# EasyEDA Pro project LCR表.eprj, board 电池内阻仪
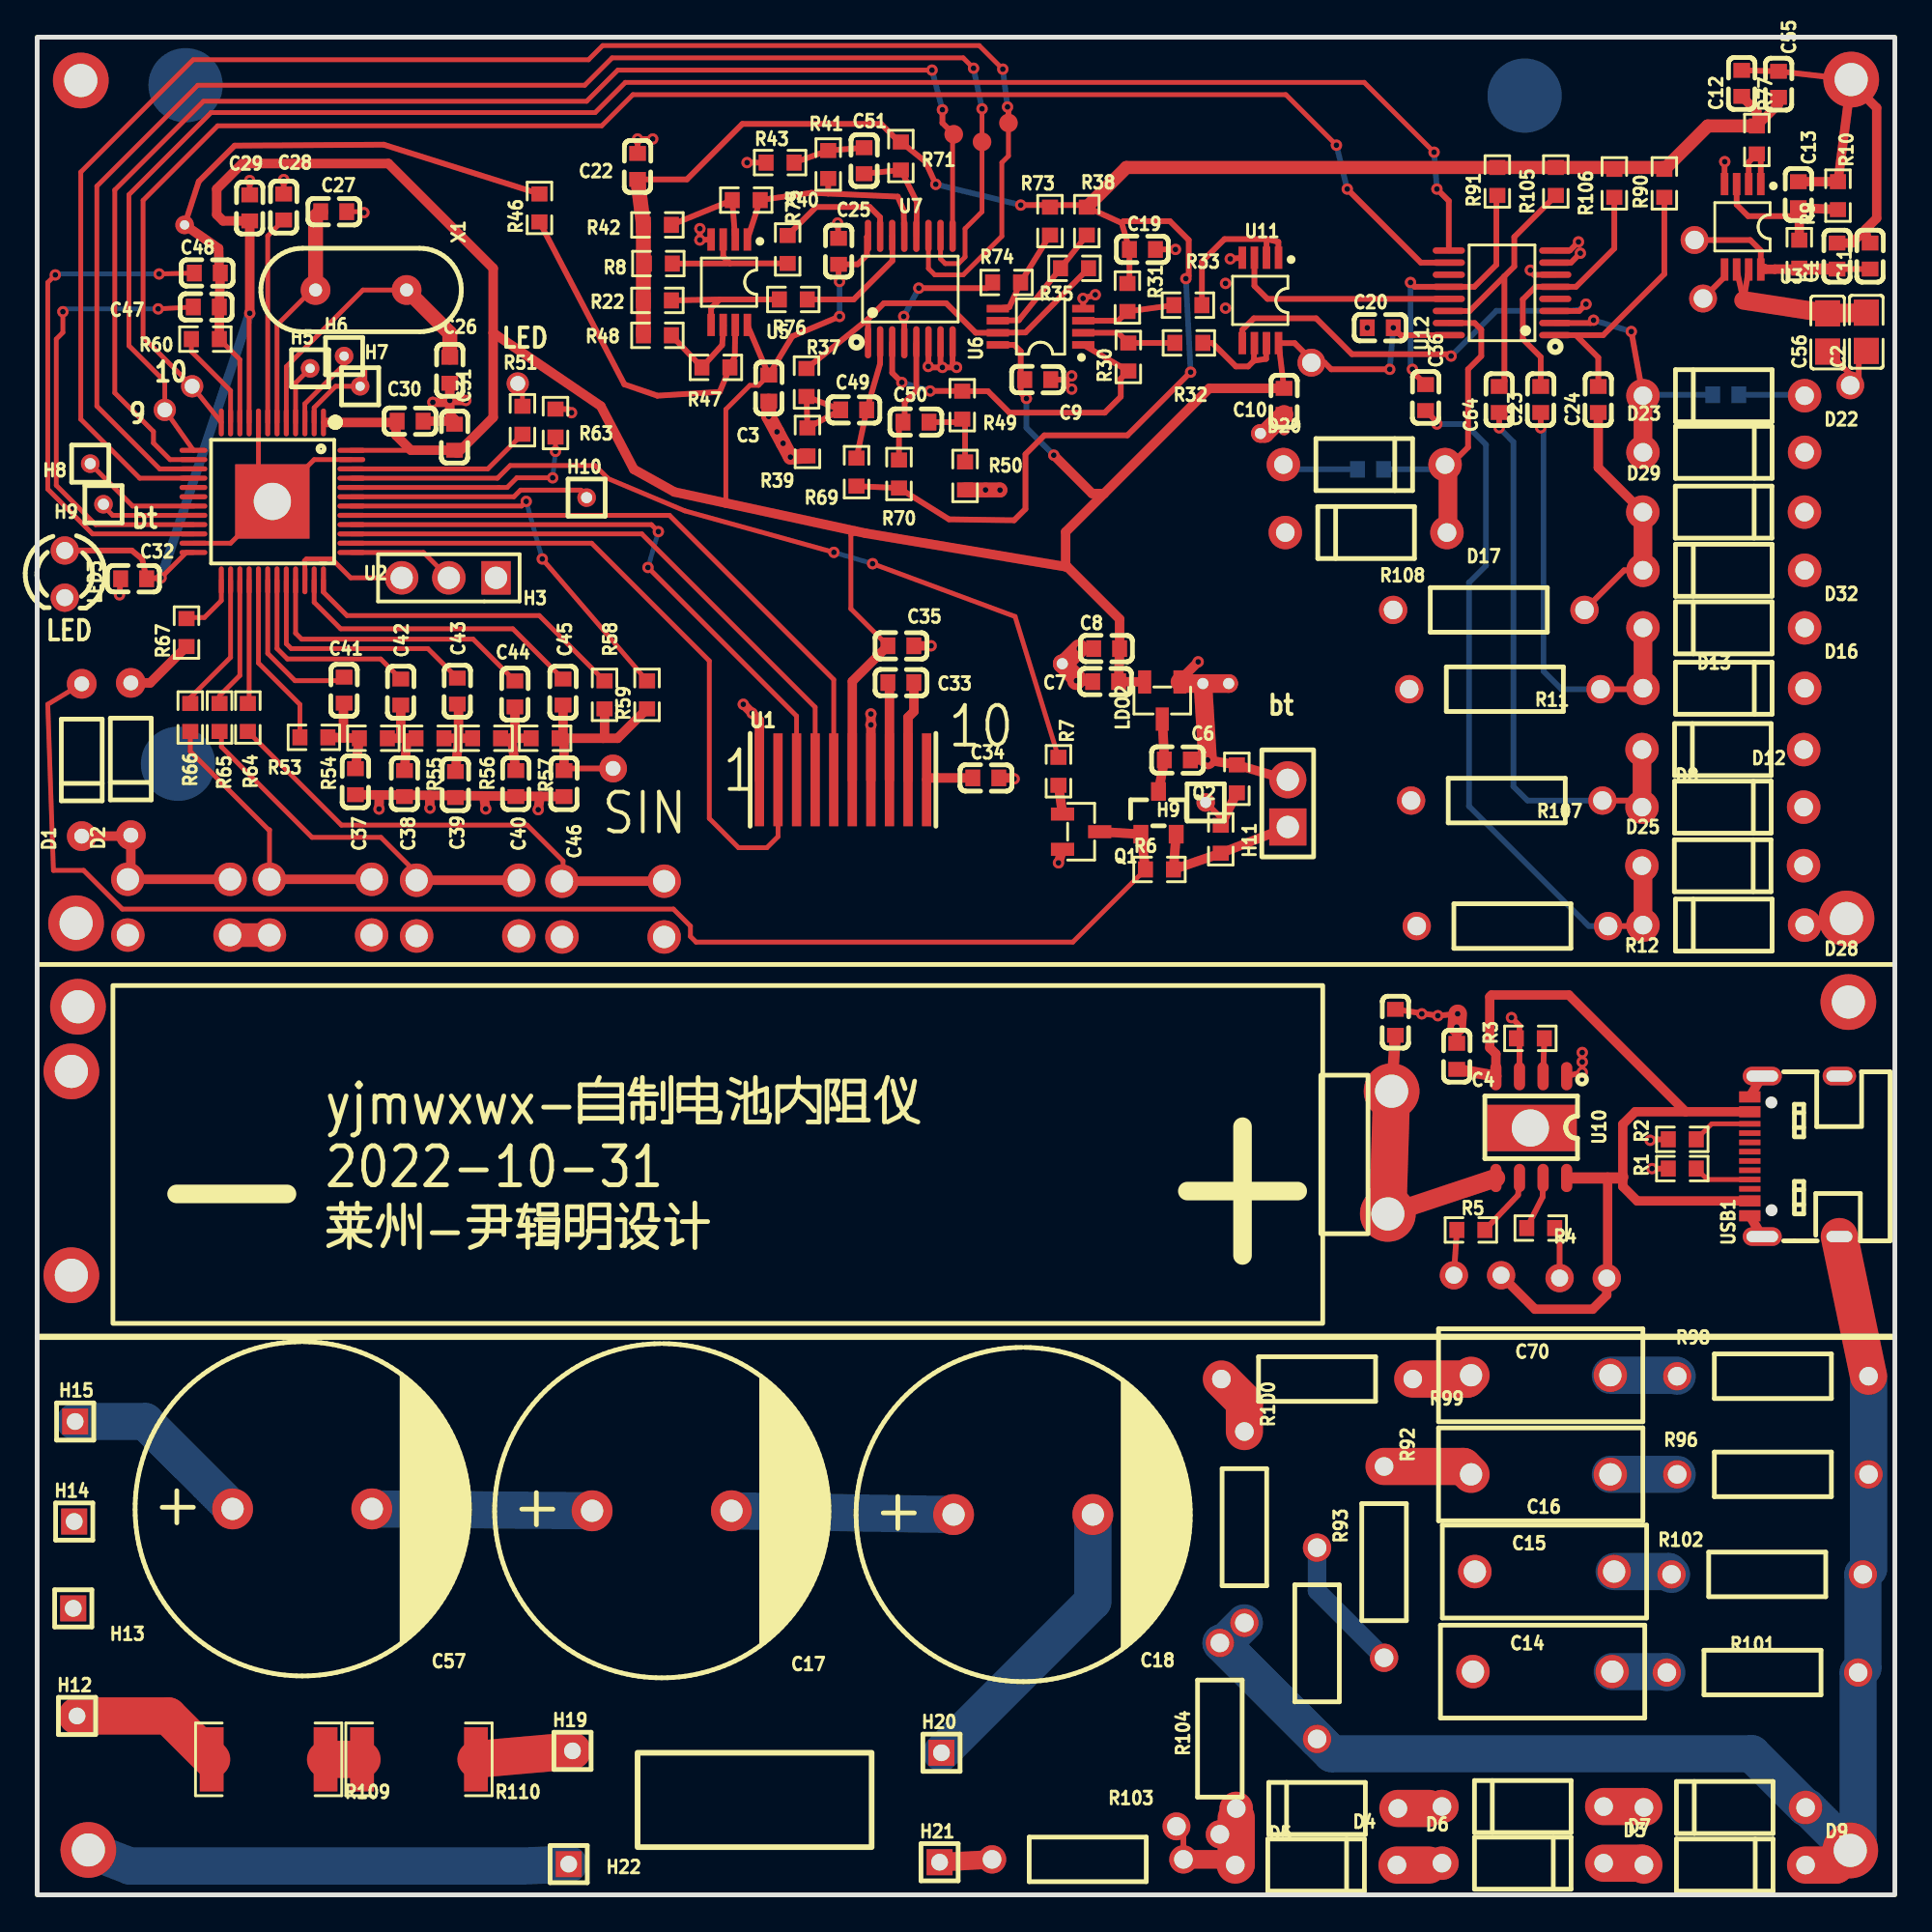
[diagram p1: board, top side]
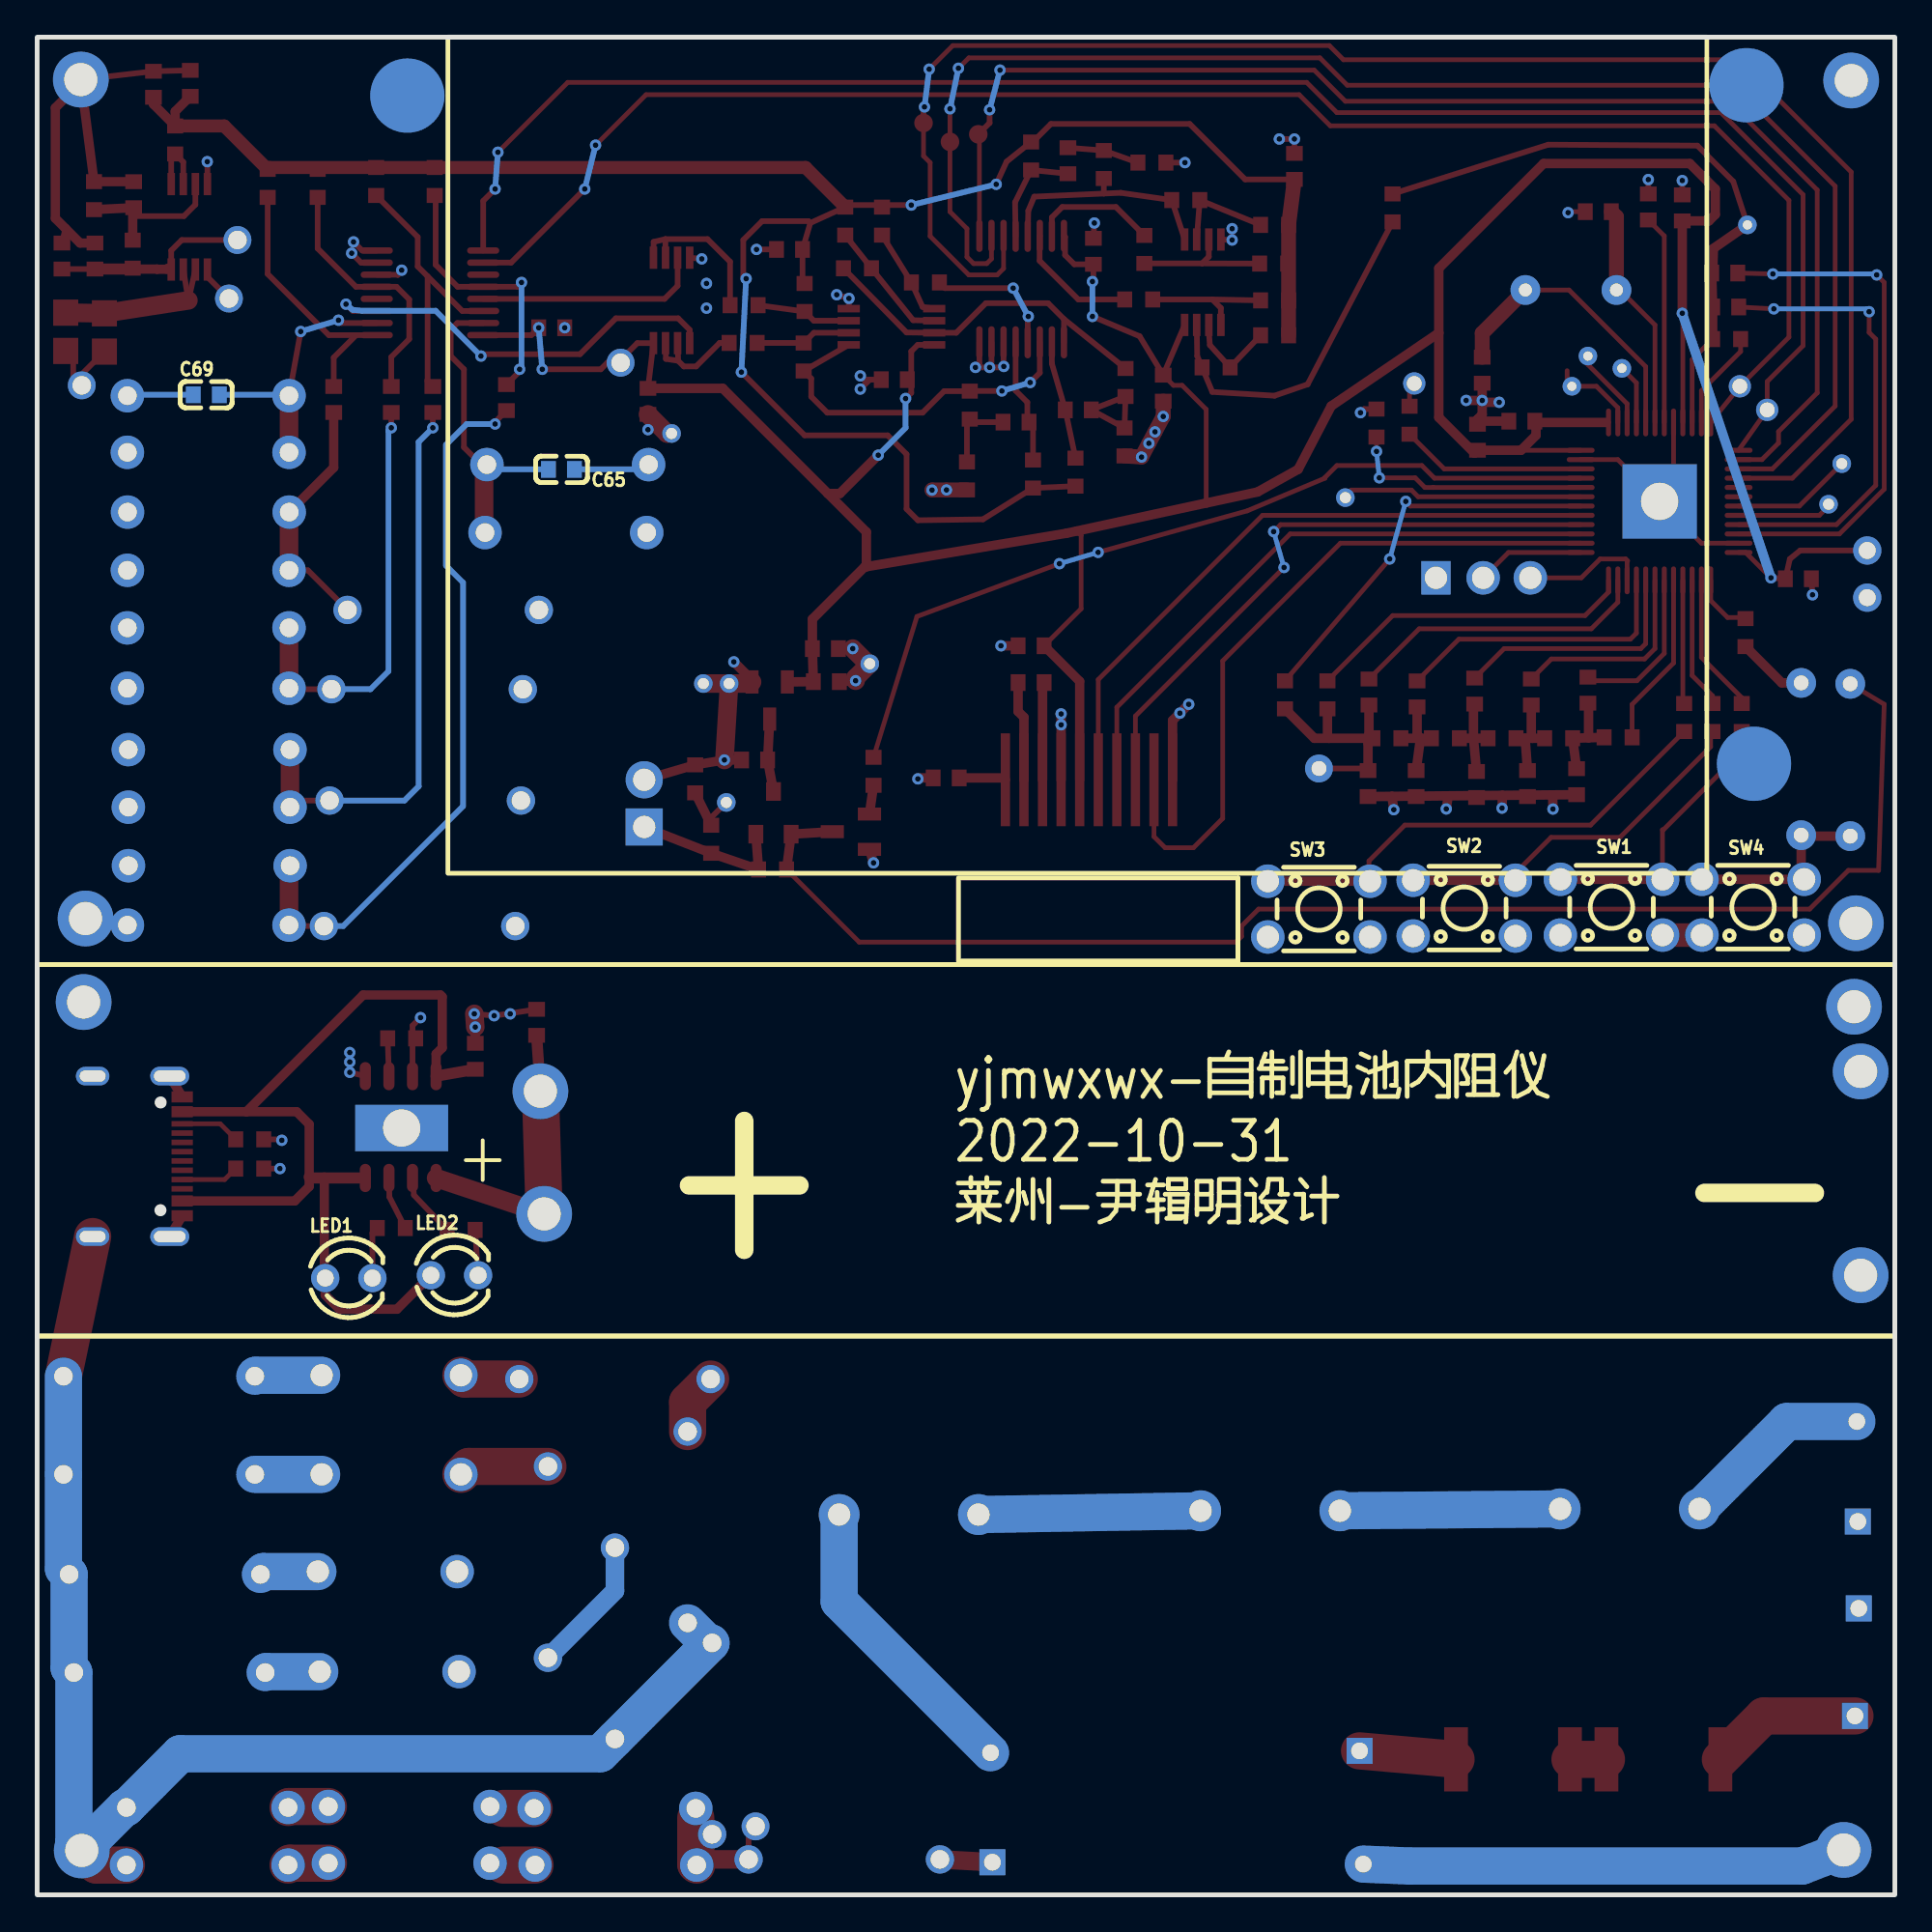
[diagram p2: board, bottom side, seen from below]

Outline 100 x 100 mm; copper layers: Top Layer, Bottom Layer. Coordinates in mm from the lower left corner of the outline.
Outline path: rectangle 0,100 100,0
Stack: Top Layer 0.035mm / Dielectric1 1.51mm FR4 er 4.5 / Bottom Layer 0.035mm

## Design rules (mm)
spacing safeClearance (default): track to track 0.152, other pairs 0.152 to 0.3
track width trackWidth (default): min 0.127, default 0.254, max 2.54
differential pair differentialPair (default): width min 0.127, default 0.254, max 2.54; gap min 0.152, default 0.152
via viaSize (default): diameter min 0.5, default 0.61, max 10; hole min 0.3, default 0.305, max 6
net GND uses copperRegion1

## Placement (name value [footprint] x y rotation side)
C1  100nF  [C0603]  96.89 88.22 90 top
C2  150nF  [C0805]  98.46 84.14 90 top
C3  150nF  [C0603]  39.38 81.11 270 top
C4  10uF  [C0603]  76.42 45.14 270 top
C5  10uF  [C0603]  73.11 46.97 270 top
C6  10uF  [C0603]  61.38 61.09 180 top
C7  100nF  [C0603]  57.52 65.31 0 top
C8  10uF  [C0603]  57.57 67.08 0 top
C9  100nF  [C0603]  53.86 81.56 0 top
C10  100nF  [C0603]  67.12 80.39 270 top
C11  100nF  [C0603]  98.67 88.22 90 top
C12  150nF  [C0603]  91.76 97.51 90 top
C13  100nF  [C0603]  94.81 91.52 270 top
C14  470uF  [CAP-TH_L11.0-W5.0-P7.50-D1.2]  81.04 12.02 0 top
C15  100nF  [CAP-TH_L11.0-W5.0-P7.50-D1.2]  81.14 17.4 0 top
C16  100nF  [CAP-TH_L11.0-W5.0-P7.50-D1.2]  80.94 22.63 0 top
C17  10uF  [CAP-TH_BD18.0-P7.50-D1.2-FD]  33.62 20.67 0 top
C18  100nF  [CAP-TH_BD18.0-P7.50-D1.2-FD]  53.08 20.47 0 top
C19  470uF  [C0603]  59.5 88.57 0 top
C20  100nF  [C0603]  72.3 84.36 0 top
C22  470uF  [C0603]  32.32 93.04 90 top
C23  470uF  [C0603]  80.94 80.5 90 top
C24  470uF  [C0603]  84.04 80.5 90 top
C25  100nF  [C0603]  43.14 88.47 270 top
C26  22pF  [C0603]  22.21 82.07 90 top
C27  22pF  [C0603]  15.96 90.61 180 top
C28  100nF  [C0603]  13.27 90.86 90 top
C29  10uF  [C0603]  11.44 90.81 90 top
C30  100nF  [C0603]  20.08 79.33 0 top
C31  100nF  [C0603]  22.47 78.46 270 top
C32  100nF  [C0603]  5.19 70.84 0 top
C33  100nF  [C0603]  46.5 65.26 180 top
C34  100nF  [C0603]  51.07 60.12 180 top
C35  100nF  [C0603]  46.5 67.24 180 top
C36  10uF  [C0603]  74.74 80.6 270 top
C37  100pF  [C0603]  17.13 59.92 90 top
C38  100pF  [C0603]  19.77 59.82 90 top
C39  100pF  [C0603]  22.52 59.77 90 top
C40  100pF  [C0603]  25.77 59.82 90 top
C41  10nF  [C0603]  16.52 64.85 90 top
C42  1nF  [C0603]  19.57 64.75 90 top
C43  40nF  [C0603]  22.62 64.8 90 top
C44  200nF  [C0603]  25.72 64.65 90 top
C45  100nF  [C0603]  28.31 64.75 90 top
C46  100pF  [C0603]  28.36 59.82 90 top
C47  100nF  [C0603]  9.11 85.47 0 top
C48  100nF  [C0603]  9.16 87.3 0 top
C49  10uF  [C0603]  43.96 79.94 180 top
C50  10uf  [C0603]  47.31 79.28 0 top
C51  470uF  [C0603]  44.51 93.35 270 top
C55  150nF  [C0603]  93.74 97.46 270 top
C56  10uF  [C0805]  96.38 84.1 90 top
C57  150uF  [CAP-TH_BD18.0-P7.50-D1.2-FD]  14.27 20.78 0 top
C64  10uF  [C0603]  78.7 80.5 90 top
C65  100nF  [C0603]  71.78 76.74 0 bottom
C69  100nF  [C0603]  90.89 80.75 180 bottom
C70  10nF  [CAP-TH_L11.0-W5.0-P7.50-D1.2]  80.94 27.97 0 top
D1  1N4148  [DO-35_BD2.0-L4.2-P8.20-D0.5-RD]  2.4 61.09 90 top
D2  1N4148  [DO-35_BD2.0-L4.2-P8.20-D0.5-RD]  5.04 61.14 90 top
D3  1N4148  [DO-41_BD2.4-L4.7-P8.70-D0.9-FD]  79.97 4.75 180 top
D4  1N4148  [DO-41_BD2.4-L4.7-P8.70-D0.9-FD]  68.9 4.65 180 top
D5  1N4148  [DO-41_BD2.4-L4.7-P8.70-D0.9-FD]  68.85 1.6 0 top
D6  1N4148  [DO-41_BD2.4-L4.7-P8.70-D0.9-FD]  79.97 1.71 0 top
D7  FR107  [DO-41_BD2.4-L4.7-P8.70-D0.9-FD]  90.84 1.6 0 top
D8  FR107  [DO-41_BD2.4-L4.7-P8.70-D0.9-FD]  90.74 58.55 0 top
D9  FR107  [DO-41_BD2.4-L4.7-P8.70-D0.9-FD]  90.84 4.7 180 top
D12  FR107  [DO-41_BD2.4-L4.7-P8.70-D0.9-FD]  90.74 61.65 180 top
D13  FR107  [DO-41_BD2.4-L4.7-P8.70-D0.9-FD]  90.79 64.95 0 top
D16  FR107  [DO-41_BD2.4-L4.7-P8.70-D0.9-FD]  90.79 68.2 180 top
D17  FR107  [DO-41_BD2.4-L4.7-P8.70-D0.9-FD]  71.54 73.33 180 top
D20  FR107  [DO-41_BD2.4-L4.7-P8.70-D0.9-FD]  71.44 76.99 0 top
D22  FR107  [DO-41_BD2.4-L4.7-P8.70-D0.9-FD]  90.79 80.7 180 top
D23  FR107  [DO-41_BD2.4-L4.7-P8.70-D0.9-FD]  90.79 77.65 0 top
D25  FR107  [DO-41_BD2.4-L4.7-P8.70-D0.9-FD]  90.73 55.4 0 top
D28  FR107  [DO-41_BD2.4-L4.7-P8.70-D0.9-FD]  90.79 52.2 180 top
D29  FR107  [DO-41_BD2.4-L4.7-P8.70-D0.9-FD]  90.78 74.43 0 top
D32  FR107  [DO-41_BD2.4-L4.7-P8.70-D0.9-FD]  90.79 71.3 180 top
H3  2.54-1*3P针  [HDR-TH_3P-P2.54-V-M-1]  22.16 70.89 180 top
H5  -  [HDR-TH_1P-V-M_XKB_X4611WV-01I-C28D40#2]  14.69 82.17 0 top
H6  -  [HDR-TH_1P-V-M_XKB_X4611WV-01I-C28D40#2]  16.52 82.83 0 top
H7  -  [HDR-TH_1P-V-M_XKB_X4611WV-01I-C28D40#2]  17.39 81.21 0 top
H8  -  [HDR-TH_1P-V-M_XKB_X4611WV-01I-C28D40]  2.86 77.04 0 top
H9  -  [HDR-TH_1P-V-M_XKB_X4611WV-01I-C28D40]  3.57 74.86 0 top
H9#2  -  [HDR-TH_1P-V-M_XKB_X4611WV-01I-C28D40]  62.9 58.8 0 top
H10  -  [HDR-TH_1P-V-M_XKB_X4611WV-01I-C28D40]  29.58 75.21 0 top
H11  18650电池  [HDR-TH_2P-P2.54-V-F]  67.32 58.75 90 top
H12  -  [HDR-TH_1P-V-M_XKB_X4611WV-01I-C28D40#3]  2.15 9.63 0 top
H13  -  [HDR-TH_1P-V-M_XKB_X4611WV-01I-C28D40#3]  1.94 15.42 0 top
H14  -  [HDR-TH_1P-V-M_XKB_X4611WV-01I-C28D40#3]  1.99 20.09 0 top
H15  -  [HDR-TH_1P-V-M_XKB_X4611WV-01I-C28D40#3]  2.05 25.48 180 top
H19  -  [HDR-TH_1P-V-M_XKB_X4611WV-01I-C28D40#3]  28.82 7.75 0 top
H20  -  [HDR-TH_1P-V-M_XKB_X4611WV-01I-C28D40#3]  48.68 7.65 0 top
H21  -  [HDR-TH_1P-V-M_XKB_X4611WV-01I-C28D40#3]  48.58 1.76 0 top
H22  -  [HDR-TH_1P-V-M_XKB_X4611WV-01I-C28D40#3]  28.61 1.65 0 top
LDO2  SC662K-3.3V  [SOT-23-3_L2.9-W1.3-P1.90-LS2.4-BR]  60.57 64.29 90 top
LED1  -  [LED-TH_BD3.0-P2.54-FD]  83.22 33.2 180 bottom
LED2  -  [LED-TH_BD3.0-P2.54-FD]  77.53 33.35 180 bottom
LED3  -  [LED-TH_BD3.0-P2.54-FD]  1.49 71.1 270 top
NOREF  -  [Pad_e209]  2.1 52.3 0 top
NOREF#2  -  [Pad_e2749]  8.34 81.21 0 top
NOREF#3  -  [Pad_e199]  97.5 48.06 0 top
NOREF#4  -  [Pad_e1343]  50.86 94.36 0 top
NOREF#5  -  [Pad_e114]  62.75 65.2 0 top
NOREF#6  -  [Pad_e1332]  52.29 95.38 0 top
NOREF#7  -  [Pad_e4477]  65.85 78.67 0 top
NOREF#8  -  [Pad_e156]  1.84 33.35 0 top
NOREF#9  -  [Pad_e1208]  89.22 89.08 0 top
NOREF#10  -  [Pad_e1199]  12.66 75.01 0 top
NOREF#11  -  [Pad_e205]  97.65 97.72 0 top
NOREF#12  -  [Pad_e1781]  97.6 81.26 0 top
NOREF#13  -  [Pad_e475]  80.07 96.85 0 top
NOREF#14  -  [Pad_e201]  97.6 2.39 0 top
NOREF#15  -  [Pad_e2863]  25.87 81.36 0 top
NOREF#16  -  [Pad_e1340]  49.34 94.77 0 top
NOREF#17  -  [Pad_e111]  55.18 66.27 0 top
NOREF#18  -  [Pad_e159]  72.71 36.66 0 top
NOREF#19  -  [Pad_e155]  1.84 44.33 0 top
NOREF#20  -  [Pad_e478]  7.99 97.41 0 top
NOREF#21  -  [Pad_e207]  2.35 97.67 0 top
NOREF#22  -  [Pad_e157]  72.91 43.26 0 top
NOREF#23  -  [Pad_e191]  2.2 47.81 0 top
NOREF#24  -  [Pad_e1224]  68.59 82.48 0 top
NOREF#25  -  [Pad_e117]  64.14 65.2 0 top
NOREF#26  -  [Pad_e1195]  89.68 85.93 0 top
NOREF#27  -  [Pad_e213]  2.76 2.42 0 top
NOREF#28  -  [Pad_e2748]  6.87 79.94 0 top
NOREF#29  -  [Pad_e211]  97.4 52.56 0 top
NOREF#30  -  [Pad_e3196]  31 60.63 0 top
NOREF#31  -  [Pad_e3514]  7.94 89.89 0 top
NOREF#32  -  [Pad_e1775]  80.38 41.28 90 top
NOREF#33  -  [Pad_e1779]  61.33 3.69 0 top
NOREF#34  -  [Pad_e479]  7.58 60.89 0 top
Q1  AO3400A  [SOT-23-3_L2.9-W1.3-P1.90-LS2.4-BR]  56.2 57.23 180 top
Q2  AO3401A  [SOT-23_L2.9-W1.3-P1.90-LS2.4-BR]  60.36 58.25 270 top
R1  10K  [R0603]  88.56 39.09 180 top
R2  10K  [R0603]  88.56 40.67 0 top
R3  1.3K  [R0603]  80.38 46.1 0 top
R4  1K  [R0603]  80.94 35.89 0 top
R5  1K  [R0603]  77.18 35.79 180 top
R6  10K  [R0603]  60.41 55.2 0 top
R7  10K  [R0603]  54.98 60.48 270 top
R8  1Ω  [R0603]  33.44 87.81 180 top
R9  1Ω  [R0603]  94.86 88.32 270 top
R10  10  [R0603]  96.94 91.47 270 top
R11  10K  [RES-TH_BD2.4-L6.3-P10.30-D0.6]  79.01 64.9 180 top
R12  10K  [RES-TH_BD2.4-L6.3-P10.30-D0.6]  79.41 52.15 180 top
R22  100  [R0603]  33.39 85.83 180 top
R30  10K  [R0603]  58.74 82.78 90 top
R31  1K  [R0603]  58.69 85.99 270 top
R32  1K  [R0603]  62 83.54 180 top
R33  1K  [R0603]  61.95 85.57 180 top
R35  6K  [R0603]  55.84 87.56 0 top
R37  900  [R0603]  41.41 81.41 90 top
R38  1K  [R0603]  56.5 90.1 270 top
R39  100  [R0603]  41.47 78.21 90 top
R40  10K  [R0603]  38.17 91.23 0 top
R41  1K  [R0603]  42.58 93.14 270 top
R42  1K  [R0603]  33.39 89.89 0 top
R43  500  [R0603]  39.99 93.25 0 top
R46  100  [R0603]  27.04 90.81 90 top
R47  10K  [R0603]  36.54 82.22 0 top
R48  3.33K  [R0603]  33.39 83.95 0 top
R49  500  [R0603]  49.8 80.19 90 top
R50  100  [R0603]  49.95 76.38 270 top
R51  1K  [R0603]  26.12 79.38 270 top
R53  1K  [R0603]  14.9 62.31 0 top
R54  1K  [R0603]  18.1 62.26 0 top
R55  1K  [R0603]  21.15 62.26 0 top
R56  1K  [R0603]  24.19 62.26 0 top
R57  1K  [R0603]  27.34 62.26 0 top
R58  10K  [R0603]  30.54 64.6 90 top
R59  10K  [R0603]  32.83 64.6 90 top
R60  10K  [R0603]  9.06 83.75 180 top
R61  10K  [R0603]  63.72 56.82 90 top
R62  10K  [R0603]  64.58 60.07 90 top
R63  10K  [R0603]  27.9 79.23 270 top
R64  10K  [R0603]  11.34 63.38 90 top
R65  10K  [R0603]  9.82 63.38 90 top
R66  10K  [R0603]  8.24 63.38 90 top
R67  10K  [R0603]  8.04 67.95 90 top
R69  100K  [R0603]  44.11 76.58 90 top
R70  100K  [R0603]  46.39 76.48 90 top
R71  1Ω  [R0603]  46.5 93.6 90 top
R73  6K  [R0603]  54.52 90.1 90 top
R74  1K  [R0603]  52.18 86.8 0 top
R75  100K  [R0603]  40.4 88.57 270 top
R76  100K  [R0603]  40.7 85.88 180 top
R77  100K  [R0603]  92.57 94.47 270 top
R90  10K  [R0603]  87.59 92.13 90 top
R91  10K  [R0603]  78.6 92.23 90 top
R92  10kΩ  [RES-TH_BD2.4-L6.3-P10.30-D0.6]  72.5 17.91 270 top
R93  10kΩ  [RES-TH_BD2.4-L6.3-P10.30-D0.6]  68.9 13.54 270 top
R96  100  [RES-TH_BD2.4-L6.3-P10.30-D0.6]  93.43 22.63 0 top
R98  10kΩ  [RES-TH_BD2.4-L6.3-P10.30-D0.6]  93.43 27.92 0 top
R99  10kΩ  [RES-TH_BD2.4-L6.3-P10.30-D0.6]  68.9 27.77 180 top
R100  10kΩ  [RES-TH_BD2.4-L6.3-P10.30-D0.6]  64.99 19.79 270 top
R101  10kΩ  [RES-TH_BD2.4-L6.3-P10.30-D0.6]  92.88 11.97 0 top
R102  10kΩ  [RES-TH_BD2.4-L6.3-P10.30-D0.6]  93.13 17.25 0 top
R103  100  [RES-TH_BD2.4-L6.3-P10.30-D0.6]  56.55 1.91 0 top
R104  1kΩ  [RES-TH_BD2.4-L6.3-P10.30-D0.6]  63.66 8.41 270 top
R105  10K  [R0603]  81.75 92.23 90 top
R106  10K  [R0603]  84.9 92.13 90 top
R107  1kΩ  [RES-TH_BD2.4-L6.3-P10.30-D0.6]  79.11 58.91 180 top
R108  1kΩ  [RES-TH_BD2.4-L6.3-P10.30-D0.6]  78.14 69.17 0 top
R109  0.5Ω  [R2512]  12.46 7.29 180 top
R110  0.5Ω  [R2512]  20.55 7.29 180 top
SW1  TC-1109-C-B  [KEY-TH_4P-L4.5-W4.5-P3.00-LS5.8]  15.25 53.17 180 bottom
SW2  TC-1109-C-B  [KEY-TH_4P-L4.5-W4.5-P3.00-LS5.8]  23.18 53.11 180 bottom
SW3  TC-1109-C-B  [KEY-TH_4P-L4.5-W4.5-P3.00-LS5.8]  31 53.06 180 bottom
SW4  TC-1109-C-B  [KEY-TH_4P-L4.5-W4.5-P3.00-LS5.8]  7.63 53.17 180 bottom
U1  -  [FPC10]  42.38 60.02 0 top
U2  N32G430C8L7  [LQFP-48_L7.0-W7.0-P0.50-LS9.0-BL]  12.66 75.01 180 top
U3  COS722MR  [MSOP-8_L3.0-W3.0-P0.65-LS4.9-BL-1]  91.81 89.79 180 top
U5  COS722MR  [MSOP-8_L3.0-W3.0-P0.65-LS4.9-BL-1]  37.25 86.81 180 top
U6  COS722MR  [MSOP-8_L3.0-W3.0-P0.65-LS4.9-BL-1]  54.01 84.41 90 top
U7  COS722MR  [TSSOP-16_L5.0-W4.4-P0.65-LS6.4-BL]  47 86.44 0 top
U10  WSP4056  [SOP-8_L5.1-W3.9-P1.27-LS6.0-BL]  80.43 41.33 180 top
U11  COS722MR  [MSOP-8_L3.0-W3.0-P0.65-LS4.9-BL-1]  65.85 85.83 180 top
U12  -  [TSSOP-16_L5.0-W4.4-P0.65-LS6.4-BL]  78.85 86.24 90 top
USB1  TYPEC-304-ACP16  [USB-C-SMD_TYPE-C-16P-1]  94.6 39.75 90 top
X1  8MHz  [OSC-TH_L10.0-W4.5-P5.00]  17.44 86.39 270 top

## Footprints (pads in the part's own frame, mm; a bottom-side part is the same pattern mirrored in y, then rotated)
C0603
  rect 0.8x0.9 smd: 1(-0.7,0) 2(0.7,0)
C0805
  rect 1.41x1.35 smd: 1(-1.03,0) 2(1.03,0)
CAP-TH_BD18.0-P7.50-D1.2-FD
  round 2.2 hole 1.199: 1(-3.749,0) 2(3.749,0)
CAP-TH_L11.0-W5.0-P7.50-D1.2
  round 1.801 hole 1.199: 1(-3.749,0) 2(3.749,0)
DO-35_BD2.0-L4.2-P8.20-D0.5-RD
  round 1.6 hole 0.8: 1(-4.099,0) 2(4.099,0)
DO-41_BD2.4-L4.7-P8.70-D0.9-FD
  round 1.801 hole 1.001: 1(-4.351,0) 2(4.351,0)
FPC10
  rect 0.5x5 smd: 1(-3.5,0) 2(-2.5,0) 3(-1.5,0) 4(-0.5,0) 5(0.5,0) 6(1.5,0) 7(2.5,0) 8(3.5,0) 9(4.5,0) 10(5.5,0)
HDR-TH_1P-V-M_XKB_X4611WV-01I-C28D40
  round 1 hole 0.6: 1(0,0)
HDR-TH_1P-V-M_XKB_X4611WV-01I-C28D40#2
  round 1 hole 0.5: 1(0,0)
HDR-TH_1P-V-M_XKB_X4611WV-01I-C28D40#3
  rect 1.399x1.399 hole 0.899: 1(0,0)
HDR-TH_2P-P2.54-V-F
  rect 1.999x1.999 hole 1.199: 1(-1.27,0)
  round 1.999 hole 1.199: 2(1.27,0)
HDR-TH_3P-P2.54-V-M-1
  rect 1.575x1.801 hole 1.199: 1(-2.54,0)
  round 1.801 hole 1.199: 2(0,0) 3(2.54,0)
KEY-TH_4P-L4.5-W4.5-P3.00-LS5.8
  round 1.801 hole 1.199: 1(-2.751,1.501) 2(2.751,1.501) 3(-2.751,-1.501) 4(2.751,-1.501)
LED-TH_BD3.0-P2.54-FD
  round 1.524 hole 0.914: 1(-1.27,0) 2(1.27,0)
LQFP-48_L7.0-W7.0-P0.50-LS9.0-BL
  oval 0.27x1.5 smd: 1(-2.75,-4.25) 2(-2.25,-4.25) 3(-1.75,-4.25) 4(-1.25,-4.25) 5(-0.75,-4.25) 6(-0.25,-4.25) 7(0.25,-4.25) 8(0.75,-4.25) 9(1.25,-4.25) 10(1.75,-4.25) 11(2.25,-4.25) 12(2.75,-4.25) 25(2.75,4.25) 26(2.25,4.25) 27(1.75,4.25) 28(1.25,4.25) 29(0.75,4.25) 30(0.25,4.25) 31(-0.25,4.25) 32(-0.75,4.25) 33(-1.25,4.25) 34(-1.75,4.25) 35(-2.25,4.25) 36(-2.75,4.25)
  oval 1.5x0.27 smd: 13(4.25,-2.75) 14(4.25,-2.25) 15(4.25,-1.75) 16(4.25,-1.25) 17(4.25,-0.75) 18(4.25,-0.25) 19(4.25,0.25) 20(4.25,0.75) 21(4.25,1.25) 22(4.25,1.75) 23(4.25,2.25) 24(4.25,2.75) 37(-4.25,2.75) 38(-4.25,2.25) 39(-4.25,1.75) 40(-4.25,1.25) 41(-4.25,0.75) 42(-4.25,0.25) 43(-4.25,-0.25) 44(-4.25,-0.75) 45(-4.25,-1.25) 46(-4.25,-1.75) 47(-4.25,-2.25) 48(-4.25,-2.75)
MSOP-8_L3.0-W3.0-P0.65-LS4.9-BL-1
  rect 0.406x1.199 smd: 1(-0.976,-2.299) 2(-0.325,-2.299) 3(0.325,-2.299) 4(0.976,-2.299) 5(0.976,2.301) 6(0.325,2.301) 7(-0.325,2.301) 8(-0.976,2.301)
OSC-TH_L10.0-W4.5-P5.00
  round 1.6 hole 0.701: 1(0,2.451) 2(0,-2.451)
Pad_e111
  round 1 hole 0.6: 3(0,0)
Pad_e114
  round 1 hole 0.6: 6(0,0)
Pad_e117
  round 1 hole 0.6: 10(0,0)
Pad_e155
  round 3 hole 1.78: 15(0,0)
Pad_e156
  round 3 hole 1.78: 26(0,0)
Pad_e157
  round 3 hole 1.78: 27(0,0)
Pad_e159
  round 3 hole 1.78: 40(0,0)
Pad_e191
  round 3 hole 1.78: 92(0,0)
Pad_e199
  round 3 hole 1.78: 112(0,0)
Pad_e201
  round 3 hole 1.78: 56(0,0)
Pad_e205
  round 3 hole 1.78: 52(0,0)
Pad_e207
  round 3 hole 1.78: 70(0,0)
Pad_e209
  round 3 hole 1.78: 89(0,0)
Pad_e211
  round 3 hole 1.78: 109(0,0)
Pad_e213
  round 3 hole 1.78: 61(0,0)
Pad_e475
  round 4 smd far side: 1(0,0)
Pad_e478
  round 4 smd far side: 9(0,0)
Pad_e479
  round 4 smd far side: 18(0,0)
Pad_e1195
  round 1.5 hole 1: 1(0,0)
Pad_e1199
  rect 4x4 hole 2: 1(0,0)
Pad_e1208
  round 1.5 hole 1: 2(0,0)
Pad_e1224
  round 1.5 hole 1: 3(0,0)
Pad_e1332
  round 1 smd: TP1(0,0)
Pad_e1340
  round 1 smd: TP2(0,0)
Pad_e1343
  round 1 smd: TP3(0,0)
Pad_e1775
  rect 2.5x5 hole 2: 2(0,0)
Pad_e1779
  round 1.5 hole 1: 3(0,0)
Pad_e1781
  round 1.5 hole 1: 7(0,0)
Pad_e2748
  round 1.2 hole 0.8: 3(0,0)
Pad_e2749
  round 1.2 hole 0.8: 5(0,0)
Pad_e2863
  round 1.2 hole 0.8: 3(0,0)
Pad_e3196
  round 1.5 hole 0.8: 6(0,0)
Pad_e3514
  round 1 hole 0.5: 9(0,0)
Pad_e4477
  round 1 hole 0.6: 13(0,0)
R0603
  rect 0.806x0.864 smd: 1(-0.753,0) 2(0.753,0)
R2512
  rect 1.282x3.456 smd: 1(-3.067,0) 2(3.067,0)
RES-TH_BD2.4-L6.3-P10.30-D0.6
  round 1.524 hole 1: 1(-5.15,0) 2(5.15,0)
SOP-8_L5.1-W3.9-P1.27-LS6.0-BL
  oval 0.6x1.519 smd: 1(-1.905,-2.74) 2(-0.635,-2.74) 3(0.635,-2.74) 4(1.905,-2.74) 5(1.905,2.74) 6(0.635,2.74) 7(-0.635,2.74) 8(-1.905,2.74)
SOT-23-3_L2.9-W1.3-P1.90-LS2.4-BR
  rect 1.25x0.7 smd: 1(1,-0.95) 2(1,0.95) 3(-1,0)
SOT-23_L2.9-W1.3-P1.90-LS2.4-BR
  rect 1x0.8 smd: 1(1.15,-0.95) 2(1.15,0.95) 3(-1.15,0)
TSSOP-16_L5.0-W4.4-P0.65-LS6.4-BL
  oval 0.343x1.732 smd: 1(-2.276,-2.865) 2(-1.625,-2.865) 3(-0.976,-2.865) 4(-0.325,-2.865) 5(0.325,-2.865) 6(0.976,-2.865) 7(1.625,-2.865) 8(2.276,-2.865) 9(2.276,2.865) 10(1.625,2.865) 11(0.976,2.865) 12(0.325,2.865) 13(-0.325,2.865) 14(-0.976,2.865) 15(-1.625,2.865) 16(-2.276,2.865)
USB-C-SMD_TYPE-C-16P-1
  rect 0.6x1.15 smd: A1B12(-3.2,2.41) A4B9(-2.4,2.41) B1A12(3.2,2.41) B4A9(2.4,2.41)
  rect 0.3x1.15 smd: A5(-1.25,2.41) A6(-0.25,2.41) A7(0.25,2.41) A8(1.25,2.41) B5(1.75,2.41) B6(0.75,2.41) B7(-0.75,2.41) B8(-1.75,2.41)
  oval 1x2.1 hole 0.6x1.7: EP(-4.32,1.74) EP(4.32,1.74)
  oval 1x1.8 hole 0.6x1.4: EP(-4.32,-2.41) EP(4.32,-2.41)

## Nets
+1.65V: C12.1 C19.1 C22.1 C55.2 R8.2 R22.2 R31.1 R38.1 R42.1 R48.1 R69.1 R70.1 R71.2 R73.2 R77.1 R90.2 R91.2 R105.2 R106.2
+3.3V: C1.1 C3.1 C7.2 C8.2 C9.1 C10.1 C11.1 C20.2 C25.2 C29.1 C30.1 C31.2 C32.2 C35.2 LDO2.2 LED3.1 NOREF#9.2 NOREF#24.3 R9.2 U1.6 U2.1 U2.9 U2.24 U2.48 U3.8 U5.8 U6.8 U7.16 U11.8 U12.16
GND: C1.2 C3.2 C4.1 C5.1 C6.1 C7.1 C8.1 C9.2 C10.2 C11.2 C12.2 C13.1 C19.2 C20.1 C22.2 C25.1 C26.1 C27.1 C28.2 C29.2 C30.2 C31.1 C32.1 C34.1 C35.1 C37.1 C38.1 C39.1 C40.1 C46.1 C55.1 C65.1 C69.1 D7.2 D8.2 D9.1 D12.1 D13.2 D16.1 D17.2 D20.1 D22.1 D23.2 D25.2 D28.1 D29.2 D32.1 H3.1 H11.2 H22.1 LDO2.1 NOREF.89 NOREF#3.112 NOREF#5.6 NOREF#7.13 NOREF#8.26 NOREF#10.1 NOREF#11.52 NOREF#13.1 NOREF#14.56 NOREF#17.3 NOREF#19.15 NOREF#20.9 NOREF#21.70 NOREF#23.92 NOREF#25.10 NOREF#27.61 NOREF#29.109 NOREF#32.2 NOREF#34.18 Q1.2 R1.2 R2.1 R3.1 R10.1 R39.1 R43.1 R50.2 R62.2 R63.1 R93.2 R96.2 R98.2 R100.2 R101.2 R102.2 R104.1 SW1.3 SW1.4 SW2.3 SW2.4 SW3.3 SW3.4 SW4.3 SW4.4 U1.1 U1.7 U2.8 U2.23 U2.47 U3.4 U5.4 U6.4 U7.6 U7.7 U7.8 U10.1 U10.3 U11.4 U12.6 U12.7 U12.8 USB1.A1B12 USB1.B1A12 USB1.EP
VCC: C4.2 LED1.1 LED2.1 U10.4 U10.8 USB1.A4B9 USB1.B4A9
+: C5.2 H11.1 NOREF#18.40 NOREF#22.27 Q2.2 R6.2 R61.1 U10.5
BT_DIANYA: H9.1 H9#2.1 R61.2 R62.1 U2.20
HC: C57.1 H15.1
HP: C16.1 H14.1 R92.1
LC: C14.1 H12.1 R109.2
LP: C70.1 H13.1 R99.1
PA0_ADC: C47.2 C48.2 NOREF#31.9 R46.2 R60.1 U2.10
PA2_4052_S0_10: NOREF#2.5 U2.12 U12.10
PA3_4052_S1_9: NOREF#28.3 U2.13 U12.9
PA4_U7_4053_6BEI: NOREF#16.TP2 U2.14 U7.9
PA5_U7_4053_10BEI: NOREF#4.TP3 U2.15 U7.10
PA6_U7_4053_3BEI: NOREF#6.TP1 U2.16 U7.11
PA13_SWDIO: H3.3 U2.34
PA14_SWCLK: H3.2 U2.37
PA15_RST: U1.2 U2.38
PB3_SPI1_SCK: U1.4 U2.39
PB4_RS: U1.3 U2.40
PB5_SPI1_MOSI: U1.5 U2.41
PB8_GUANJI: R7.1 U2.45
PB9_LCD_BEIGUANG: R51.2 U2.46
PB12_KAIJI: D2.2 R67.1
SIN: C45.1 C46.2 NOREF#26.1 NOREF#30.6 R57.2 R58.1 R59.1 U3.5
$1N5478: R1.1 USB1.A5
$1N5501: R2.2 USB1.B5
$1N5982: R3.2 U10.2
$1N6392: LED1.2 R4.2
$1N6468: LED2.2 R5.2
$1N6485: R4.1 U10.7
$1N7176: R5.1 U10.6
$1N9457: C6.2 LDO2.3 Q2.3
$1N9972: D1.2 Q1.3 Q2.1 R6.1
$1N10161: Q1.1 R7.2
$1N30303: U11.5 U12.3
$1N31719: R31.2 R33.2 U6.3
$1N32954: R30.2 R32.2 U6.2
$1N33172: R32.1 U11.6 U11.7
$1N33324: R33.1 U11.1 U11.2
$1N39125: R73.1 R74.2 U6.5
$1N40913: R40.1 R42.2 U5.2
$1N42299: R8.1 R75.2 U5.3
$1N44948: R22.1 R76.2 U5.5
$1N45128: R46.1 R47.2 U5.7
$1N45678: R47.1 R48.2 U5.6
$1N49359: R35.2 R37.2 U6.7 U7.1
$1N49560: R75.1 U7.15
$1N49953: R40.2 R41.2 U5.1 U7.13
$1N50153: R76.1 U7.14
$1N55108: C26.2 U2.5 X1.1
$1N55316: C27.2 U2.6 X1.2
$1N56684: C28.1 U2.7
$1N65263: C33.2 U1.8
$1N65484: C33.1 U1.9
$1N65778: C34.2 U1.10
$1N76678: LED3.2 NOREF#15.3 R51.1
$1N79731: R53.1 U2.29
$1N83028: C38.2 C42.1 R54.2 R55.1
$1N83269: C39.2 C43.1 R55.2 R56.1
$1N83512: C40.2 C44.1 R56.2 R57.1
$1N86336: C41.2 U2.30
$1N86592: C42.2 U2.31
$1N86848: C43.2 U2.32
$1N87104: C44.2 U2.33
$1N87360: C45.2 U2.35
$1N88068: R58.2 U2.36
$1N90333: R59.2 U2.42
$1N94084: R60.2 U2.11
$1N95256: C48.1 U2.22
$1N95522: C47.1 U2.21
$1N103910: U2.18
$1N104798: R63.2 U2.44
$1N112001: R67.2 U2.25
$1N112276: R66.2 U2.26
$1N112550: R65.2 U2.27
$1N112826: R64.2 U2.28
$1N130277: H5.1 U2.4
$1N130572: H6.1 U2.3
$1N130867: H7.1 U2.2
$1N131552: H8.1 U2.19
$1N132476: H10.1 U2.43
$1N150454: D1.1 D2.1 SW4.1 SW4.2
$1N155250: R66.1 SW1.1 SW1.2
$1N156292: R65.1 SW2.1 SW2.2
$1N157433: R64.1 SW3.1 SW3.2
$1N176679: C37.2 C41.1 R53.2 R54.1
$1N182949: C49.1 R69.2 U7.2
$1N183233: C49.2 R37.1 R39.2
$1N191358: C51.1 R41.1 R43.2
$1N191653: C51.2 R71.1 U7.12
$1N202848: R74.1 U7.4
$1N203128: R35.1 R38.2 U6.6
$1N211469: C50.2 R49.1 R50.1
$1N212873: R30.1 R49.2 U6.1 U7.3
$1N213170: C50.1 R70.2 U7.5
$1N235974: C13.2 R9.1 R10.2 U3.3
$1N236262: R77.2 U3.1 U3.2
$1N303994: H21.1 R103.1
$1N317093: C69.2 D22.2 D23.1 R92.2 R93.1 U12.2
$1N322528: C65.2 D17.1 D20.2 R99.2 R100.1 U12.15
$1N334067: C15.1 H19.1 R110.1
$1N339052: C24.2 R90.1 U12.1
$1N344999: C64.2 R105.1 U12.14
$1N351109: C16.2 R96.1 R108.1
$1N351850: C70.2 R12.2 R98.1
$1N351852: C36.1 R91.1 U12.12
$1N353507: C23.2 R106.1 U12.5
$1N360431: C17.1 C57.2
$1N360618: C17.2 C18.1
$1N361076: C18.2 H20.1
$1N392753: D3.1 D9.2
$1N392999: D3.2 D4.1
$1N393491: D5.2 D6.1
$1N393738: D6.2 D7.1
$1N395728: C64.1 D8.1 D12.2 R107.1
$1N395731: C15.2 R102.1 R107.2
$1N396765: C23.1 D13.1 D16.2 R11.1
$1N396767: C14.2 R11.2 R101.1
$1N402893: C24.1 D29.1 D32.2 R108.2
$1N404819: C36.2 D25.1 D28.2 R12.1
$1N410667: U11.3 U12.13
$1N412255: U12.4
$1N418395: C2.1 C56.1 D4.2 D5.1 NOREF#12.7 NOREF#33.3 R103.2 R104.2
$1N418401: C2.2 C56.2 U3.6 U3.7
$1N429504: R109.1 R110.2

Pads without a net: U2 17; U12 11; USB1 A6 A7 A8 B6 B7 B8

## Via types
v1: diameter 0.61, hole 0.305, Top Layer to Bottom Layer, 109 vias

## Routing (per net, layer and track width the routed paths; a pad name or vN(x,y) marks a point on that pad's centre or on a via; arc(x,y) is an arc through that point)
+1.65V: length 117.7
  Top Layer w0.305: v1(52.95,90.96) 56.39,90.96 R38.1 58.38,90 ; R69.1 R70.1 49.09,74.04 52.59,73.99 53.2,74.6 53.2,77.55 54.22,78.57 58.69,78.57 v1(62.09,81.97) ; 58.38,90 C19.1 58.8,86.85 R31.1 ; 58.38,90 58.48,90.1 60.97,90.1 61.99,89.08 61.99,87.15 v1(61.84,87) ; v1(48.37,92.08) 47.82,93.3 R71.2 46.4,94.36 45.43,95.33 37.96,95.33 34.97,92.34 C22.1
  Top Layer w0.5: C12.1 92.57,96 R77.1 93.74,96.39 C55.2
  Top Layer w0.7: R77.1 89.93,95.22 R90.2 87.49,92.98 R105.2 R91.2 58.64,92.98 R38.1
  Top Layer w0.8: R48.1 R22.2 R42.1 C22.1
  Bottom Layer w0.305: v1(48.37,92.08) v1(52.95,90.96) ; v1(62.09,81.97) v1(61.84,87)
+3.3V: length 214.2
  Top Layer w0.254: C31.2 22.46,77.76 U2.48 ; 44.03,73.41 43.8,73.18 43.8,69.23 C35.2 ; 11.41,90.08 C29.1 ; v1(6.67,70.89) 8.03,72.26 U2.24 ; C3.1 38.84,81.26 38.37,81.26 37.07,79.96 37.07,74.92 ; U2.9 11.41,85.11 ; U2.1 15.56,79.26
  Top Layer w0.305: v1(73,84.36) 73.4,83.96 U12.16 ; v1(72.81,82.12) 69.66,82.12 69.3,82.48 NOREF#24.3 68.59,82.63 67.69,83.53 66.82,83.53 C10.1 ; LED3.1 5.09,72.37 5.65,71.91 C32.2 v1(6.67,70.89) ; U6.8 52.6,83.44 52.95,83.09 52.95,80.85 v1(53.25,80.55) ; 96.94,87.52 C11.1 ; U5.8 C3.1 40.65,83.9 v1(43.19,84.97) ; 93.03,87.51 93.01,87.49 U3.8 92.78,88.51 92.22,89.08 NOREF#9.2 ; 44.73,89.3 44.67,89.24 44.67,88.27 44.17,87.77 C25.2 43.14,86.9 v1(43.19,86.85)
  Top Layer w0.5: 94.81,87.52 93.54,87.52 93.54,87.51 93.03,87.51 92.98,87.56 ; U1.6 43.88,65.32 C35.2
  Top Layer w0.508: 55.36,71.49 44.6,73.29 44.03,73.41 37.07,74.92 34.3,75.52 32.12,76.74 30.34,80.14 24.55,84.08 ; 55.36,71.49 55.45,71.49 58.27,68.67 C8.2 C7.2 LDO2.2 ; 55.36,71.49 55.36,73.36 57.44,75.44 ; 24.55,84.08 24.55,79.53 22.62,77.61 C31.2 20.12,77.76 19.32,78.57 19.32,79.25 19.31,79.26 ; 24.55,84.08 24.55,87.56 18.91,93.2 11.04,93.2 9.67,91.82 9.67,90.45 10.01,90.11 C29.1 v1(11.44,85.14) 11.41,85.11 ; 57.44,75.44 63.09,81.09 C10.1 ; 57.44,75.44 56.79,75.44 v1(54.72,77.5) ; 19.31,79.26 15.56,79.26 ; 19.31,79.26 19.38,79.33
  Top Layer w0.6: 96.94,87.52 C1.1 94.81,87.52 94.81,87.52
  Bottom Layer w0.305: v1(72.81,82.12) v1(73,84.36) ; v1(53.25,80.55) 53.25,78.97 v1(54.72,77.5) ; v1(43.19,86.85) v1(43.19,84.97)
  Bottom Layer w0.508: v1(6.67,70.89) v1(11.44,85.14)
GND: length 249.2
  Top Layer w0.254: NOREF#10.1 11.91,75.76 U2.8 ; NOREF#10.1 14.91,77.26 U2.47 ; NOREF#10.1 10.41,72.76 U2.23 ; v1(17.59,90.55) 17.54,90.61 C27.1
  Top Layer w0.305: U12.7 82.56,87.86 v1(83.07,88.37) ; v1(64.22,88.06) U11.4 ; v1(11.44,92.28) C29.2 ; v1(80.38,87.46) 80.38,87.41 80.58,87.2 80.59,87.21 U12.6 ; v1(48.73,82.22) 48.02,82.22 v1(47.97,82.27) 47.98,82.28 U7.6 ; v1(48.73,82.22) 48.63,82.33 U7.7 ; v1(48.73,82.22) v1(49.49,82.22) 49.28,82.44 49.28,83.57 ; U10.3 79.79,46.79 v1(79.36,47.22) ; C19.2 v1(61.28,88.57) ; 55.18,81.56 55.49,81.56 v1(55.69,81.77) ; 55.18,81.56 v1(55.69,81.06) ; 55.18,81.56 C9.2 ; U12.8 82.5,88.51 v1(82.97,88.98) ; v1(83.17,45.34) v1(83.17,44.83) v1(83.17,44.28) U10.1 ; C12.2 C55.1 NOREF#11.52 ; R2.1 86.88,40.67 v1(86.83,40.62) ; v1(28.77,79.78) 28.57,79.98 R63.1 ; v1(35.67,89.69) v1(35.67,89.08) U5.4 ; v1(33.13,94.52) v1(32.32,94.52) C22.2 ; R43.1 v1(38.21,93.25) ; U3.4 90.83,93.29 v1(90.84,93.3) ; v1(56.96,86.14) v1(56.3,85.94) 56.31,85.39 ; C11.2 98.48,89.7 ; C25.1 v1(43.09,90) ; C5.1 v1(75.4,47.32) v1(76.47,47.42) ; v1(13.27,92.33) C28.2 ; R1.2 v1(86.93,39.09) ; v1(67.12,78.87) C10.2 ; v1(4.43,69.98) C32.1
  Top Layer w0.5: v1(63,61.09) R62.2 H11.2 ; C13.1 R10.1 NOREF#11.52 97.65,97.56 99.02,96.19 99.02,90.25 97.69,88.92 96.94,88.92 ; C4.1 v1(76.42,46.71)
  Top Layer w0.508: 18.42,59.21 21.12,59.19 ; 18.42,59.21 C37.1 ; 18.42,59.21 v1(18.4,58.45) ; 21.12,59.19 v1(21.15,58.5) ; 21.12,59.19 24.04,59.16 ; v1(63,61.09) 62.08,61.09 ; 44.87,63.58 v1(44.88,63.57) v1(44.88,62.98) U1.7 ; v1(24.15,58.45) 24.04,59.16 ; 24.04,59.16 27.07,59.13 ; v1(22.21,80.44) v1(23.08,80.44) ; v1(22.21,80.44) C26.1 ; v1(22.21,80.44) 22.11,80.34 v1(21.3,80.34) ; v1(22.21,80.44) 22.21,79.68 22.47,79.43 C31.1 22.3,79.33 C30.2 ; C34.1 52.54,60.12 v1(52.59,60.07) ; U1.1 38.88,63.22 v1(38.49,63.61) v1(38.01,64.09) ; 27.07,59.13 v1(26.97,58.42) ; 27.07,59.13 C46.1 ; LDO2.1 61.52,65.39 v1(62.5,66.37) ; Q1.2 v1(54.98,55.55) ; USB1.EP USB1.B1A12 ; USB1.EP USB1.A1B12 ; v1(55.94,65.36) C7.1 ; v1(48.12,67.24) C35.1 ; v1(56.1,67.08) C8.1
  Top Layer w0.8: R50.2 v1(51.05,75.63) 51.82,75.63 v1(51.83,75.62) ; R39.1 v1(40.55,77.4) v1(40.16,78.14) v1(39.83,78.75) v1(39.38,79.58) C3.2
  Top Layer w1: LDO2.1 61.6,65.2 NOREF#5.6 ; NOREF#7.13 66.09,78.67 C10.2 ; v1(63,61.09) NOREF#5.6 ; NOREF#5.6 NOREF#25.10 ; v1(55.94,65.36) 55.94,65.51 NOREF#17.3 55.28,66.27 v1(56.1,67.08) ; v1(76.42,46.71) v1(76.47,47.42)
  Top Layer w1.27: SW4.3 SW1.4
  Top Layer w2: D7.2 96.81,1.6 NOREF#14.56 ; R98.2 USB1.EP
  Bottom Layer w0.305: C65.1 67.34,76.74 D20.1 ; C69.1 95.09,80.75 D22.1
  Bottom Layer w2: R98.2 R96.2 98.58,17.56 R102.2 98.28,12.22 98.03,11.97 98.03,2.82 NOREF#14.56 95.29,4.7 D9.1 92.3,7.6 69.69,7.6 R93.2 63.73,13.56 63.91,13.56 R100.2 ; NOREF#27.61 4.99,1.55 26.12,1.55 H22.1
  vias: v1(63.97,86.74) v1(63.97,85.41) v1(71.6,84.36) v1(74.54,47.42)
VCC: length 53.5
  Top Layer w0.5: 88.74,42.15 USB1.B4A9 ; 88.74,42.15 86.03,42.15 85.36,41.48 85.36,38.13 86.13,37.35 USB1.A4B9 ; 88.74,42.15 82.45,48.44 78.3,48.44 78.19,48.34 78.19,45.6 78.52,45.27 U10.4 ; 84.54,38.59 84.54,33.25 84.49,33.2 84.49,32.29 83.73,31.53 80.63,31.53 LED2.1
  Top Layer w0.6: U10.8 85.31,38.59 85.36,38.64 ; U10.4 C4.2
+: length 24.2
  Top Layer w0.5: R6.2 R61.1 H11.1
  Top Layer w0.508: R6.2 Q2.2
  Top Layer w0.6: C5.2 NOREF#22.27
  Top Layer w1: U10.5 NOREF#18.40
  Top Layer w2: NOREF#18.40 NOREF#22.27
BT_DIANYA: length 8.5
  Top Layer w0.254: 3.62,74.7 4.06,74.26 U2.20
  Top Layer w0.305: R61.2 63.72,57.99 H9#2.1
  Top Layer w0.5: R62.1 R61.2
HC: length 10.4
  Bottom Layer w2: H15.1 5.81,25.48 C57.1
HP: length 4.9
  Top Layer w2: R92.1 76.76,23.06 C16.1
LC: length 8.2
  Top Layer w2: R109.2 7.06,9.63 H12.1
LP: length 3.2
  Top Layer w2: C70.1 76.99,27.77 R99.1
PA0_ADC: length 34.2
  Top Layer w0.254: U2.10 10.91,82.64 R60.1
  Top Layer w0.305: R46.2 18.66,94.21 10.63,94.16 8.7,92.23 NOREF#31.9
  Top Layer w0.508: NOREF#31.9 9.77,88.62 9.81,87.09 ; C48.2 9.81,85.57 ; C47.2 R60.1
PA2_4052_S0_10: length 91
  Top Layer w0.254: 70.07,94.06 67.22,96.9 32.07,96.9 30.39,95.23 9.72,95.23 5.7,91.22 5.7,83.85 NOREF#2.5 U2.12
  Top Layer w0.305: U12.10 74.49,87.86 v1(70.52,91.82)
  Bottom Layer w0.305: v1(70.52,91.82) v1(69.94,94.19)
PA3_4052_S1_9: length 94.9
  Top Layer w0.254: U2.13 NOREF#28.3 6.87,81.46 4.94,83.39 4.94,91.52 9.36,95.94 30.04,95.94 31.66,97.56 71.44,97.56 v1(75.2,93.81)
  Top Layer w0.305: v1(75.35,91.82) 75.99,91.18 U12.9
  Bottom Layer w0.305: v1(75.35,91.82) v1(75.2,93.81)
PA4_U7_4053_6BEI: length 72.9
  Top Layer w0.254: v1(48.17,98.22) 31.25,98.22 29.58,96.55 8.95,96.55 4.18,91.77 4.18,80.85 6.26,78.77 6.26,78.15 7.16,77.26 U2.14 ; 49.28,89.3 49.28,94.71 NOREF#16.TP2
  Top Layer w0.305: v1(48.73,96.09) 48.73,95.38 NOREF#16.TP2
  Bottom Layer w0.305: v1(48.17,98.22) v1(48.73,96.09)
PA5_U7_4053_10BEI: length 82.1
  Top Layer w0.254: v1(50.41,98.33) 49.85,98.89 30.95,98.89 29.48,97.41 8.65,97.41 3.21,91.98 3.21,80.14 6.59,76.76 U2.15 ; U7.10 48.63,88.06 48.88,87.81 49.59,87.81 49.95,88.17 49.95,89.69 50.86,90.61 NOREF#4.TP3 v1(50.86,96.14)
  Bottom Layer w0.305: v1(50.41,98.33) v1(50.86,96.14)
PA6_U7_4053_3BEI: length 89.6
  Top Layer w0.254: v1(51.98,98.28) 50.71,99.55 30.44,99.55 29.68,98.78 8.39,98.78 2.35,92.74 2.35,79.43 5.52,76.26 U2.16 ; NOREF#6.TP1 52.29,93.6 51.93,93.25 51.93,89.28 49.85,87.2 48.32,87.2 47.98,87.55 U7.11
  Top Layer w0.305: v1(52.24,96.24) 52.29,96.19 NOREF#6.TP1
  Bottom Layer w0.305: v1(51.98,98.28) v1(52.24,96.24)
PA13_SWDIO: length 6.8
  Top Layer w0.254: U2.34 14.41,71.79 14.39,71.81 14.49,71.91 15.86,71.91 16.88,70.89 H3.3
PA14_SWCLK: length 5.8
  Top Layer w0.254: U2.37 20.8,72.26 H3.2
PA15_RST: length 38
  Top Layer w0.254: U1.2 39.88,56.97 39.28,56.37 37.76,56.37 36.18,57.94 36.18,66.42 29.85,72.76 U2.38
PB3_SPI1_SCK: length 32.7
  Top Layer w0.254: U2.39 32.55,73.26 41.88,63.93 U1.4
PB4_RS: length 33.4
  Top Layer w0.254: U1.3 40.88,63.45 v1(32.88,71.45) ; U2.40 33.06,73.76 v1(33.44,73.38)
  Bottom Layer w0.254: v1(32.88,71.45) v1(33.44,73.38)
PB5_SPI1_MOSI: length 35
  Top Layer w0.254: U2.41 34.04,74.26 42.88,65.42 U1.5
PB8_GUANJI: length 45.5
  Top Layer w0.254: v1(44.97,71.66) 52.64,68.81 R7.1 ; v1(42.89,72.27) 34.86,74.5 30.68,76.26 30.7,76.28 30.04,76.94 25.46,76.94 24.78,76.26 U2.45
  Bottom Layer w0.254: v1(44.97,71.66) v1(42.89,72.27)
PB9_LCD_BEIGUANG: length 10
  Top Layer w0.254: U2.46 24.26,76.76 R51.2
PB12_KAIJI: length 3.8
  Top Layer w0.508: R67.1 6.08,65.24 D2.2
SIN: length 15.5
  Top Layer w0.305: NOREF#30.6 28.47,60.63 C46.2 ; NOREF#26.1 90.83,87.09 U3.5
  Top Layer w0.508: 30.46,62.26 30.54,62.35 R58.1 ; 30.46,62.26 R57.2 ; 30.46,62.26 31.25,62.26 R59.1 ; R57.2 28.36,62 C46.2 ; R57.2 28.31,62.47 C45.1
$1N5478: length 3.1
  Top Layer w0.254: R1.1 89.32,39.09 89.91,38.5 USB1.A5
$1N5501: length 3.2
  Top Layer w0.254: R2.2 90.15,41.5 USB1.B5
$1N5982: length 2
  Top Layer w0.305: U10.2 R3.2
$1N6392: length 2.8
  Top Layer w0.305: LED1.2 81.95,35.63 R4.2
$1N6468: length 2.4
  Top Layer w0.305: R5.2 LED2.2
$1N6485: length 2.9
  Top Layer w0.305: U10.7 81.04,37.57 R4.1
$1N7176: length 3.5
  Top Layer w0.305: U10.6 79.72,37.67 R5.1
$1N9457: length 3.9
  Top Layer w0.508: Q2.3 C6.2 LDO2.3
$1N9972: length 77.5
  Top Layer w0.254: R6.1 55.75,51.29 35.47,51.29 35.17,51.59 35.17,52.15 34.25,53.06 4.58,53.06 2.5,55.15 0.88,55.15 0.57,64.09 D1.2
  Top Layer w0.508: Q1.3 Q2.1 R6.1
$1N10161: length 1.6
  Top Layer w0.508: Q1.1 R7.2
$1N30303: length 23.2
  Top Layer w0.305: v1(83.38,85.63) 83.01,85.26 81.72,85.26 ; v1(76.11,82.83) 76.01,82.93 70.78,82.93 68.85,84.86 65.49,84.86 64.87,84.25 U11.5
  Bottom Layer w0.305: v1(76.11,82.83) 78.55,85.27 82.51,85.27 83.02,85.32 v1(83.38,85.63)
$1N31719: length 5.1
  Top Layer w0.305: 61.19,85.57 R31.2 58.19,84.74 56.31,84.74
$1N32954: length 5.2
  Top Layer w0.305: R32.2 58.74,83.54 R30.2 58.19,84.09 56.31,84.09
$1N33172: length 5.9
  Top Layer w0.305: U11.6 65.49,82.58 ; 65.49,82.58 65.19,82.27 64.53,82.27 63.26,83.54 R32.1 ; 65.49,82.58 66.15,82.68 U11.7
$1N33324: length 8.8
  Top Layer w0.305: 66.82,88.13 66.81,88.98 66.18,89.13 ; 66.18,89.13 63.92,89.13 62.7,87.91 R33.1 ; 66.18,89.13 U11.2
$1N39125: length 5.1
  Top Layer w0.305: U6.5 52.34,85.47 R74.2 R73.1
$1N40913: length 5.7
  Top Layer w0.305: U5.2 R40.1 R42.2
$1N42299: length 7.6
  Top Layer w0.305: U5.3 36.93,88.18 37.29,87.82 ; R8.1 37.29,87.82 ; 37.29,87.82 R75.2
$1N44948: length 7.4
  Top Layer w0.305: 36.74,85.88 36.28,85.42 U5.5 ; 36.74,85.88 R76.2 ; 36.74,85.88 R22.1
$1N45128: length 18.9
  Top Layer w0.305: U5.7 37.55,82.83 R47.2 36.74,80.9 33.39,80.7 31.61,81.31 27.04,90.06
$1N45678: length 5.1
  Top Layer w0.305: U5.6 36.95,84.48 36.87,83.42 R47.1 R48.2
$1N49359: length 19.8
  Top Layer w0.305: 44.73,83.57 44.73,84.82 ; 44.73,84.82 R37.2 ; 44.73,84.82 45.58,85.68 48.93,85.68 50.52,84.09 U6.7 53.2,84.1 R35.2
$1N49560: length 6.8
  Top Layer w0.305: R75.1 41.93,90.86 44.82,90.86 45.38,90.3 45.38,89.3
$1N49953: length 12.7
  Top Layer w0.305: U7.13 46.65,90.66 46.33,91.42 42.58,91.58 ; U5.1 R40.2 41.67,91.62 42.58,91.58 ; R41.2 42.58,91.58
$1N50153: length 6.8
  Top Layer w0.305: R76.1 43.96,85.88 46.04,87.96 46.04,89.29 U7.14
$1N55108: length 15.8
  Top Layer w0.254: X1.1 17.54,86.39 13.41,82.26 U2.5
  Top Layer w0.8: X1.1 22.21,84.06 C26.2
$1N55316: length 12.4
  Top Layer w0.254: X1.2 14.8,86.39 12.91,84.5 U2.6
  Top Layer w0.8: X1.2 14.99,90.33 C27.2
$1N56684: length 11.3
  Top Layer w0.254: 13.27,90.16 12.41,89.3 U2.7
$1N65263: length 5.3
  Top Layer w0.508: C33.2 45.88,65.17 U1.8
$1N65484: length 5.4
  Top Layer w0.508: C33.1 47.19,63.7 46.88,63.39 U1.9
$1N65778: length 2.5
  Top Layer w0.508: U1.10 47.98,60.12 C34.2
$1N76678: length 1.3
  Top Layer w0.254: NOREF#15.3 26.12,81.11 R51.1
$1N79731: length 9.4
  Top Layer w0.254: U2.29 11.91,66.31 14.14,64.08 R53.1
$1N83028: length 5.1
  Top Layer w0.508: 19.51,62.26 19.57,62.32 C42.1 ; 19.51,62.26 R54.2 ; 19.51,62.26 19.9,62.26 ; 19.9,62.26 R55.1 ; 19.9,62.26 C38.2
$1N83269: length 5.2
  Top Layer w0.508: C39.2 22.68,62.26 ; 22.68,62.26 R55.2 ; 22.68,62.26 R56.1 ; 22.68,62.26 22.68,64.03 C43.1
$1N83512: length 5.2
  Top Layer w0.508: 25.54,62.26 R57.1 ; 25.54,62.26 25.72,62.44 C44.1 ; 25.54,62.26 R56.2 ; 25.54,62.26 C40.2
$1N86336: length 8.7
  Top Layer w0.254: C41.2 16.33,65.36 13.88,65.36 12.41,66.83 U2.30
$1N86592: length 11
  Top Layer w0.254: U2.31 12.91,67.09 13.47,66.53 18.49,66.53 C42.2
$1N86848: length 13.4
  Top Layer w0.254: U2.32 13.41,67.35 13.68,67.08 21.03,67.08 C43.2
$1N87104: length 15.7
  Top Layer w0.254: C44.2 23.47,67.59 14.24,67.59 13.91,67.92 U2.33
$1N87360: length 16.3
  Top Layer w0.254: C45.2 25.61,68.15 16.34,68.15 14.91,69.58 U2.35
$1N88068: length 17.7
  Top Layer w0.254: R58.2 27.03,68.86 16.67,68.86 15.41,70.13 U2.36
$1N90333: length 21.4
  Top Layer w0.254: v1(26.33,75.01) 26.08,74.76 U2.42 ; R59.2 v1(27.19,71.91)
  Bottom Layer w0.254: v1(27.19,71.91) v1(26.33,75.01)
$1N94084: length 5.4
  Top Layer w0.254: R60.2 8.3,83.08 10.41,80.97 U2.11
$1N95256: length 28
  Top Layer w0.254: U2.22 2.98,73.26 0.57,75.67 0.57,86.8 v1(0.98,87.2) ; v1(6.57,87.25) C48.1
  Bottom Layer w0.254: v1(0.98,87.2) 1.03,87.25 v1(6.57,87.25)
$1N95522: length 24.8
  Top Layer w0.254: U2.21 3.14,73.76 1.03,75.87 1.03,83.75 1.38,84.1 v1(1.38,85.22) ; v1(6.52,85.37) C47.1
  Bottom Layer w0.254: v1(6.52,85.37) 1.54,85.37 v1(1.38,85.22)
$1N104798: length 13.3
  Top Layer w0.254: U2.44 24.84,75.76 ; 24.84,75.76 25.3,75.76 25.82,76.28 v1(27.75,76.28) ; 24.84,75.76 24.85,75.77 ; v1(27.9,77.7) R63.2
  Bottom Layer w0.254: v1(27.75,76.28) v1(27.9,77.7)
$1N112001: length 3.4
  Top Layer w0.254: U2.25 9.91,69.67 9,68.76 8.1,68.76 R67.2
$1N112276: length 7.5
  Top Layer w0.254: U2.26 10.41,66.61 8.24,64.44 R66.2
$1N112550: length 7.1
  Top Layer w0.254: R65.2 9.82,64.55 10.91,65.64 U2.27
$1N112826: length 6.7
  Top Layer w0.254: U2.28 11.41,64.2 R64.2
$1N130277: length 3.2
  Top Layer w0.254: H5.1 13.91,81.39 U2.4
$1N130572: length 5.5
  Top Layer w0.254: 17.54,81 17.64,81.11 17.64,82.05 ; H6.1 16.52,82.38 14.41,80.27 U2.3
$1N130867: length 3.5
  Top Layer w0.254: U2.2 14.91,80.05 16.07,81.21 17.19,81.21
$1N131552: length 6.5
  Top Layer w0.254: H8.1 5.14,74.76 U2.19
$1N132476: length 12.9
  Top Layer w0.254: U2.43 25.66,75.26 26.02,75.62 29.27,75.62 29.58,75.31
$1N150454: length 10.6
  Top Layer w0.508: SW4.1 SW4.2 5.04,54.83 D2.1 4.99,56.99 D1.1
$1N155250: length 15.3
  Top Layer w0.254: SW1.2 12.51,54.67 12.51,57.33 12.46,57.33 8.24,61.55 8.24,62.62
  Top Layer w0.508: SW1.2 SW1.1
$1N156292: length 20.1
  Top Layer w0.254: 9.82,62.62 9.92,62.52 9.92,61.8 14.8,56.92 18.5,56.92 20.43,55 20.43,54.62
  Top Layer w0.508: 20.43,54.62 SW2.1
$1N157433: length 26.5
  Top Layer w0.254: SW3.2 28.31,54.62 28.31,55.66 26.38,57.58 16.38,57.58 11.34,62.62
  Top Layer w0.508: SW3.2 SW3.1
$1N176679: length 5.2
  Top Layer w0.508: C41.1 16.49,64.11 16.49,62.28 ; 16.49,62.28 R54.1 C37.2 ; 16.49,62.28 R53.2
$1N182949: length 6.4
  Top Layer w0.305: R69.2 C49.1 45.38,82.43 45.38,83.57
$1N183233: length 5.7
  Top Layer w0.305: C49.2 R37.1 R39.2 C49.2
$1N191358: length 3.9
  Top Layer w0.305: C51.1 R41.1 R43.2
$1N191653: length 5.7
  Top Layer w0.305: U7.12 47.36,91.11 R71.1 C51.2
$1N202848: length 7.2
  Top Layer w0.305: U7.4 46.68,84.94 v1(46.65,84.97) ; R74.1 51.13,86.49 v1(47.46,86.49)
  Bottom Layer w0.305: v1(46.65,84.97) v1(47.46,86.49)
$1N203128: length 7
  Top Layer w0.305: U6.6 52.84,84.76 R35.1 R38.2
$1N211469: length 4.2
  Top Layer w0.305: R50.1 49.95,79.29 R49.1 49.64,79.28 C50.2
$1N212873: length 19.4
  Top Layer w0.305: 56.31,83.44 R30.1 58.33,81.62 58.33,80.65 57.47,79.78 52.34,79.78 51.18,80.94 R49.2 49.79,80.95 v1(48.07,80.95) ; v1(46.55,81.41) 46.03,81.93 U7.3
  Bottom Layer w0.305: v1(48.07,80.95) v1(46.55,81.41)
$1N213170: length 6.7
  Top Layer w0.305: U7.5 47.33,80.97 46.7,80.34 46.7,79.37 C50.1 46.39,79.06 R70.2
$1N235974: length 9
  Top Layer w0.305: U3.3 91.48,90.98 92.1,90.37 94.81,90.37
  Top Layer w0.5: R10.2 C13.2 ; C13.2 94.81,90.37 ; C13.2 94.86,90.77 R9.1
$1N236262: length 3.5
  Top Layer w0.305: U3.1 92.78,93.5 R77.2 92.13,93.28 U3.2
$1N303994: length 2.8
  Top Layer w1: H21.1 R103.1
$1N317093: length 22
  Top Layer w0.305: v1(83.78,84.76) 83.63,84.61 U12.2 ; D22.2 v1(85.81,84.15)
  Top Layer w1: D22.2 D23.1
  Bottom Layer w0.305: v1(83.78,84.76) v1(85.81,84.15) ; C69.2 86.49,80.75 D22.2
  Bottom Layer w1: R93.1 68.9,16.37 R92.2
$1N322528: length 19.9
  Top Layer w0.305: U12.15 77.38,84.61 77.74,84.25 77.74,82.83 77.03,82.12 77.03,77.92 75.99,76.89
  Top Layer w1: 75.99,76.89 75.94,76.84 75.94,73.79
  Top Layer w2: R100.1 64.99,26.53 R99.2
  Bottom Layer w0.305: D20.2 75.53,76.74 C65.2
$1N334067: length 5.2
  Top Layer w2: H19.1 23.62,7.29
$1N339052: length 14.6
  Top Layer w0.305: 82.83,83.96 84.3,83.96 87.59,87.25 R90.1 ; 82.83,83.96 U12.1 ; 82.83,83.96 84.04,82.75 C24.2
$1N344999: length 15.3
  Top Layer w0.305: C64.2 78.98,81.47 78.98,87.12 ; 75.99,85.26 77.12,85.26 78.98,87.12 ; 78.98,87.12 79.51,87.66 79.51,89.24 R105.1
$1N351109: length 3.6
  Bottom Layer w2: C16.2 R96.1
$1N351850: length 3.6
  Bottom Layer w2: C70.2 88.23,27.97 R98.1
$1N351852: length 14.8
  Top Layer w0.305: R91.1 78.55,91.43 78.55,87.75 77.36,86.56 U12.12 74.16,86.56 v1(73.93,86.8) ; C36.1 74.03,82.01 v1(74.03,82.12)
  Bottom Layer w0.305: v1(73.93,86.8) 73.93,82.22 v1(74.03,82.12)
$1N353507: length 13.9
  Top Layer w0.305: R106.1 84.9,88.62 82.84,86.56 U12.5 80.65,86.56 79.97,85.88 79.97,83.75 80.94,82.78 C23.2
$1N360431: length 11.9
  Bottom Layer w2: C57.2 C17.1
$1N360618: length 12
  Bottom Layer w2: C17.2 C18.1
$1N361076: length 16.2
  Bottom Layer w2: C18.2 56.83,15.8 H20.1
$1N392753: length 2.2
  Top Layer w2: D9.2 86.44,4.75 D3.1
$1N392999: length 1.7
  Top Layer w2: D4.1 74.91,4.65
$1N393491: length 1.7
  Top Layer w2: D5.2 74.91,1.6
$1N393738: length 2.2
  Top Layer w2: D7.1 86.39,1.71 D6.2
$1N395728: length 30.9
  Top Layer w0.305: R107.1 86.03,58.91 D8.1 ; v1(78.7,78.97) C64.1
  Top Layer w1: D8.1 D12.2
  Bottom Layer w0.305: v1(78.7,78.97) 79.46,78.21 79.46,59.67 80.23,58.91 R107.1
$1N395731: length 3.2
  Bottom Layer w2: 87.98,17.25 87.83,17.4 C15.2
$1N396765: length 23
  Top Layer w0.305: v1(80.94,78.97) C23.1 ; D13.1 86.39,64.9 R11.1
  Top Layer w1: D16.2 D13.1
  Bottom Layer w0.305: v1(80.94,78.97) 81.09,78.82 81.09,65.87 82.06,64.9 R11.1
$1N396767: length 3
  Bottom Layer w2: R101.1 87.67,12.02 C14.2
$1N402893: length 13.5
  Top Layer w0.305: 83.29,69.17 85.43,71.3 D32.2
  Top Layer w0.5: D29.1 84.04,76.83 C24.1
  Top Layer w1: D29.1 86.44,74.42 D32.2
$1N404819: length 39.2
  Top Layer w0.305: R12.1 86.39,52.15 D28.2 ; C36.2 75.35,79.29 v1(75.35,79.17)
  Top Layer w1: D28.2 86.44,55.34 D25.1
  Bottom Layer w0.305: R12.1 83.53,52.15 77.08,58.6 77.08,70.64 77.99,71.56 77.99,78.06 76.87,79.17 v1(75.35,79.17)
$1N410667: length 12.3
  Top Layer w0.305: U12.13 66.23,85.91 65.52,86.61 U11.3
$1N418395: length 13.4
  Top Layer w0.305: 64.55,4.14 R104.2 ; C56.1 97.6,81.85 NOREF#12.7 98.06,81.72 98.06,83.07 98.43,83.07 C2.1 ; R103.2 61.7,3.31 NOREF#33.3
  Top Layer w1: D5.1 64.19,1.91 R103.2
  Top Layer w2: 64.55,4.14 64.55,1.65 D5.1
$1N418401: length 10
  Top Layer w0.305: U3.7 91.86,85.83 U3.6
  Top Layer w1: C2.2 C56.2 91.86,85.83
$1N429504: length 2
  Top Layer w2: R110.2 15.53,7.29

## Copper pours and planes (outline as drawn; the poured copper is in the pictures)
GND on Top Layer: 0.01,78.36 100.04,78.36 100.04,32.08 0.01,32.08
GND on Bottom Layer: 0,100 99.99,100 99.99,32.08 0,32.08

## Text on the board
Bottom Silkscreen Layer: + | - | yjmwxwx-自制电池内阻仪 / 2022-10-31 / 莱州-尹辑明设计
Top Silkscreen Layer: LED | 9 | bt | 10 | SIN | 1 | - | + | yjmwxwx-自制电池内阻仪 / 2022-10-31 / 莱州-尹辑明设计
